# Altium schematic sheet MCU.SchDoc
size Letter
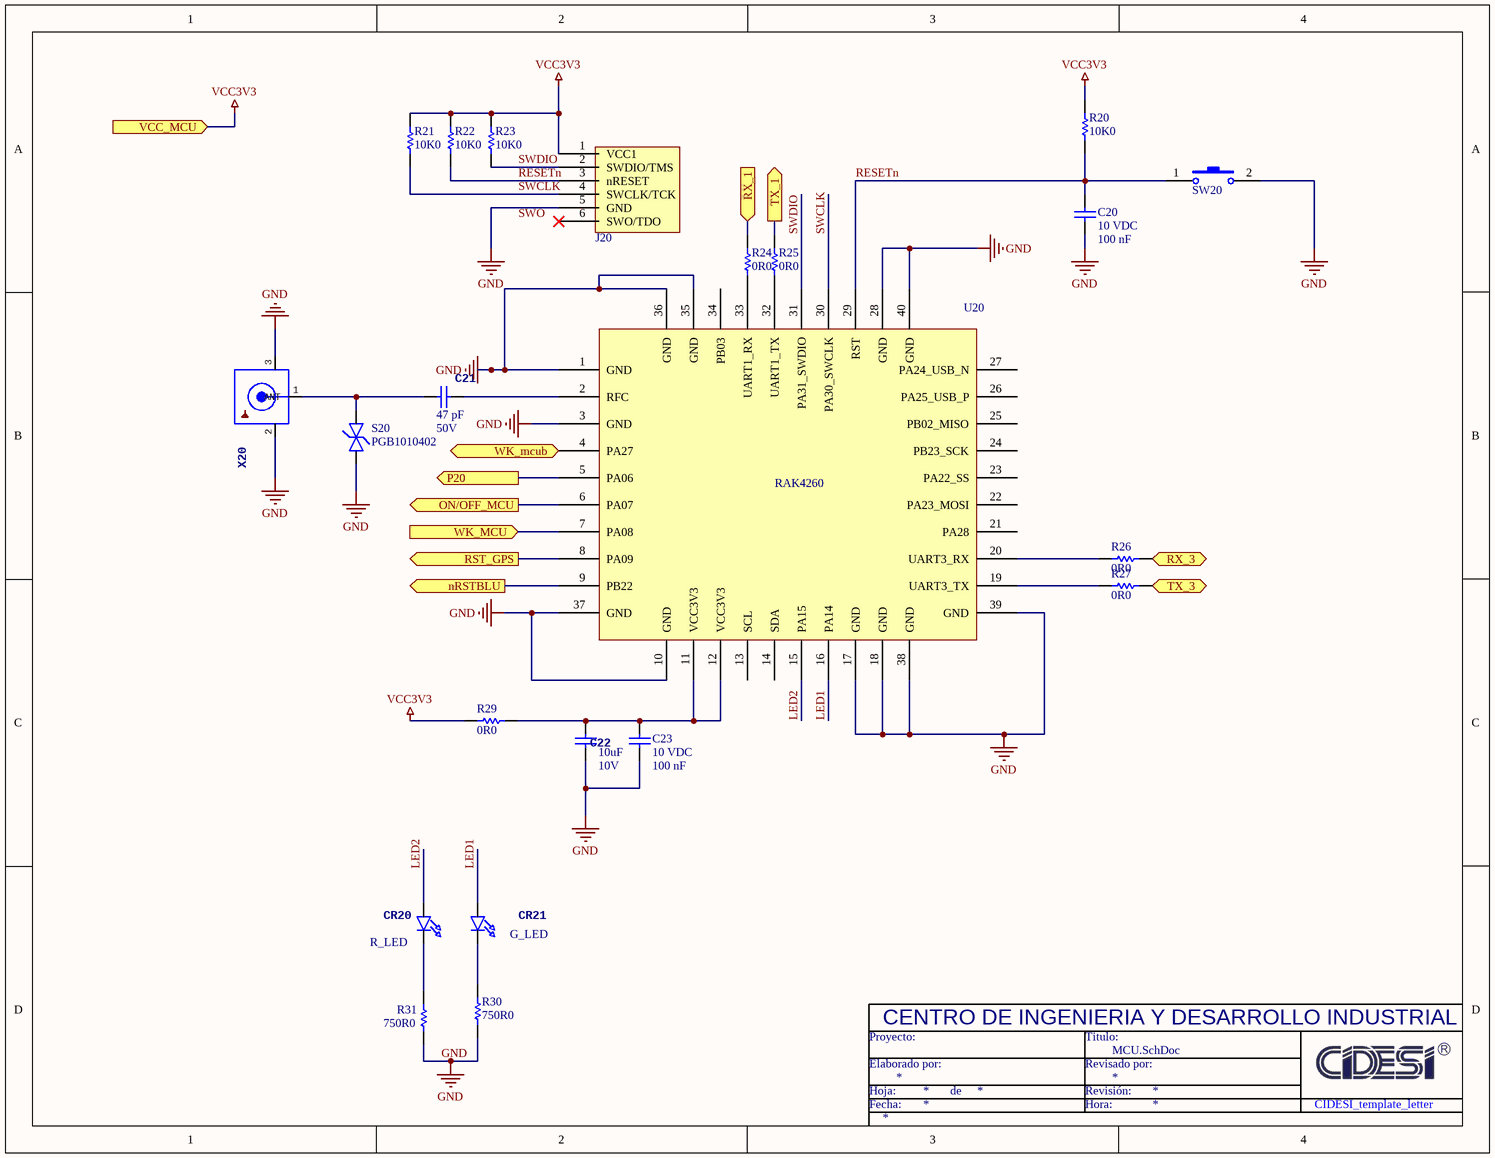
[diagram p0: MCU.SchDoc]

## Parts
C20  Voltage Rating DC: 10 VDC  Capacitance - nF: 100 nF  [C0402]  (hidden comment: 100 nF, 10 V)
C21  Capacitance: 47 pF  Voltage Rating DC: 50V  [C0402]  (hidden comment: GCQ1555C1H470JB01D)
C22  Capacitance: 10uF  Voltage Rating DC: 10V  [C0402]  (hidden comment: ZRB15XR61A106ME01D)
C23  Voltage Rating DC: 10 VDC  Capacitance - nF: 100 nF  [C0402]  (hidden comment: 100 nF, 10 V)
CR20  Product: R_LED  [0603_LED]  (hidden comment: KO DELLS1.22-KHLI-24)
CR21  Product: G_LED  [0603_LED]  (hidden comment: KG DELMS1.22-PHQI-24-E6L6)
J20  ICSP  [TC2030-MCP-NL]  (value not drawn)
R20  value 10K0  [0402_RES]  (hidden comment: CRCW040210K0FKTD)
R21  value 10K0  [0402_RES]  (hidden comment: CRCW040210K0FKTD)
R22  value 10K0  [0402_RES]  (hidden comment: CRCW040210K0FKTD)
R23  value 10K0  [0402_RES]  (hidden comment: CRCW040210K0FKTD)
R24  PANASONIC ELECTRONIC COMPONENTS  [0402_RES]  (value not drawn)
R25  PANASONIC ELECTRONIC COMPONENTS  [0402_RES]  (value not drawn)
R26  PANASONIC ELECTRONIC COMPONENTS  [0402_RES]  (value not drawn)
R27  PANASONIC ELECTRONIC COMPONENTS  [0402_RES]  (value not drawn)
R29  PANASONIC ELECTRONIC COMPONENTS  [0402_RES]  (value not drawn)
R30  Resistance: 750R0  [0402_RES]  (hidden comment: ERJ-2GEJ751X)
R31  Resistance: 750R0  [0402_RES]  (hidden comment: ERJ-2GEJ751X)
S20  PGB1010402  [Supresor_0402]
SW20  95C04A3GWRT  [Push Button SMDsin]  (value not drawn)
U20  RAK4260  [RAK4260]
X20  RECE.20279.001E.01  [U.FL]  (value not drawn)

## Ports
nRSTBLU (out), ON/OFF_MCU (out), P20 (out), RST_GPS (out), RX_1 (in), RX_3 (in), TX_1 (out), TX_3 (out), VCC_MCU (in), WK_MCU (in), WK_mcub (in)

## Nets
GND: C20.2 C22.2 C23.2 J20.5(GND) R30.1 R31.2 S20.2 SW20.2 U20.1(GND) U20.3(GND) U20.10(GND) U20.17(GND) U20.18(GND) U20.28(GND) U20.35(GND) U20.36(GND) U20.37(GND) U20.38(GND) U20.39(GND) U20.40(GND) X20.2(GND) X20.3(GND)
VCC3V3: J20.1(VCC1) R20.2 R21.2 R22.2 R23.2 R29.1 ; port VCC_MCU
LED1: CR21.A U20.16(PA14)
LED2: CR20.A U20.15(PA15)
nRSTBLU: U20.9(PB22) ; port nRSTBLU
ON/OFF_MCU: U20.6(PA07) ; port ON/OFF_MCU
P20: U20.5(PA06) ; port P20
RESETn: C20.1 J20.3(nRESET) R20.1 R22.1 SW20.1 U20.29(RST)
RST_GPS: U20.8(PA09) ; port RST_GPS
RX_1: R24.2 ; port RX_1
RX_3: R26.2 ; port RX_3
SWCLK: J20.4(SWCLK/TCK) R21.1 U20.30(PA30_SWCLK)
SWDIO: J20.2(SWDIO/TMS) R23.1 U20.31(PA31_SWDIO)
TX_1: R25.2 ; port TX_1
TX_3: R27.2 ; port TX_3
WK_MCU: U20.7(PA08) ; port WK_MCU
WK_mcub: U20.4(PA27) ; port WK_mcub
NetC21_1: C21.1 S20.1 X20.1(ANT)
NetC21_2: C21.2 U20.2(RFC)
NetC22_1: C22.1 C23.1 R29.2 U20.11(VCC3V3) U20.12(VCC3V3)
NetCR20_K: CR20.K R31.1
NetCR21_K: CR21.K R30.2
NetR24_1: R24.1 U20.33(UART1_RX)
NetR25_1: R25.1 U20.32(UART1_TX)
NetR26_1: R26.1 U20.20(UART3_RX)
NetR27_1: R27.1 U20.19(UART3_TX)

Not connected (* = marked no-connect by the designer): J20 6(SWO/TDO)*; U20 13(SCL) 14(SDA) 21(PA28) 22(PA23_MOSI) 23(PA22_SS) 24(PB23_SCK) 25(PB02_MISO) 26(PA25_USB_P) 27(PA24_USB_N) 34(PB03)

## Notes on the sheet
- Labels drawn without touching a wire or pin: SWO
- Proyecto:
- CENTRO DE INGENIERIA Y DESARROLLO INDUSTRIAL
- Titulo:
- Fecha:
- Hoja:
- Elaborado por:
- de
- Hora:
- Revisión:
- Revisado por:
- CIDESI_template_letter

## Library data of the parts
C20 C23 = 100 nF, 10 V: Multilayer Ceramic Capacitors MLCC - SMD/SMT 0402 0.1uF 10volts X7R 10%; Manufacturer: Murata Electronics; Manufacturer Part Number: GRM155R71A104KA01D; Type: General Purpose MLCC; Capacitance - pF: 100000 pF; Qualification: Commercial; Supplier 1: Mouser; RoHS: RoHS Compliant; Category: Multilayer Ceramic Capacitors MLCC - SMD/SMT; Stock 1: 259611; Pricing 1: 1=0.100, 10=0.006, 100=0.004, 500=0.003, 10000=0.003 (USD); Capacitance: 0.1 uF; Height: 0.5 mm; Length: 1 mm; Package / Case: 0402 (1005 metric); Packaging: Reel; Product: General Type MLCCs; Series: GRM; Termination Style: SMD/SMT; Tolerance: 10 %; Width: 0.5 mm; Brand: Murata Electronics; Case Code - in: 0402; Case Code - mm: 1005; Dielectric: X7R; Maximum Operating Temperature: + 125 C; Minimum Operating Temperature: - 55 C; Standard Pack Qty: 10000; RoHS - Mouser: Y; Minimum Order Quantity: 1; Reeling: True; ComponentLink1URL: http://www.mouser.com/ds/2/281/c02e-2905.pdf; ComponentLink1Description: http://www.mouser.com/ds/2/281/c02e-2905.pdf; Supplier Part Number 1: 81-GRM155R71A104KA1D
C21 = 47pF, 50V: Cap_Cer; Manufacturer: Murata Electronics; Tolerance: 5 %; Type: High Q Chip Multilayer Ceramic Capacitors for Automotive; Dielectric: C0G (NP0); Qualification: AEC-Q200; Supplier 1: Mouser; Manufacturer Part Number: GCQ1555C1H470JB01D; RoHS: RoHS Compliant; Category: Multilayer Ceramic Capacitors MLCC - SMD/SMT; Stock 1: 18694; Pricing 1: 1=0.455, 10=0.319, 100=0.191, 500=0.143, 1000=0.121, 2500=0.100, 5000=0.095, 10000=0.086, 20000=0.083 (MXN); Height: 0.5 mm; Length: 1 mm; Package / Case: 0402 (1005 metric); Packaging: Cut Tape; Product: Automotive MLCCs; Series: GCQ; Termination Style: SMD/SMT; Width: 0.5 mm; Brand: Murata Electronics; Case Code - in: 0402; Case Code - mm: 1005; Maximum Operating Temperature: + 125 C; Minimum Operating Temperature: - 55 C; Product Type: Ceramic Capacitors; Standard Pack Qty: 10000; Subcategory: Capacitors; Termination: Standard; RoHS - Mouser: Y; Minimum Order Quantity: 1; Reeling: True; ComponentLink1URL: https://www.mouser.com/datasheet/2/281/GCQ1555C1HR51WB01-01-1154307.pdf; ComponentLink1Description: https://www.mouser.com/datasheet/2/281/GCQ1555C1HR51WB01-01-1154307.pdf; Supplier Part Number 1: 81-GCQ1555C1H470JB1D
C22 = 10uF, 10V: Cap_Cer; Manufacturer: Murata Electronics; Tolerance: 20 %; Type: General Purpose Multilayer Ceramic Chip Capacitor; Class: Class 2; Dielectric: X5R; Supplier 1: Mouser; Manufacturer Part Number: ZRB15XR61A106ME01D; RoHS: RoHS Compliant; Category: Multilayer Ceramic Capacitors MLCC - SMD/SMT; Stock 1: 361820; Pricing 1: 1=0.624, 10=0.436, 100=0.261, 500=0.196, 1000=0.165, 2500=0.137, 5000=0.129, 8000=0.117, 24000=0.113 (MXN); Height: 0.65 mm; Length: 1 mm; Package / Case: 0402 (1005 metric); Packaging: Cut Tape; Product: General Type MLCCs; Series: ZRB; Termination Style: SMD/SMT; Width: 0.5 mm; Brand: Murata Electronics; Case Code - in: 0402; Case Code - mm: 1005; Maximum Operating Temperature: + 85 C; Minimum Operating Temperature: - 55 C; Product Type: Ceramic Capacitors; Standard Pack Qty: 8000; Subcategory: Capacitors; Termination: Interposer Substrate; RoHS - Mouser: Y; Minimum Order Quantity: 1; Reeling: True; ComponentLink1URL: https://www.mouser.com/datasheet/2/281/ZRB15XR61A106ME01-01-1771691.pdf; ComponentLink1Description: https://www.mouser.com/datasheet/2/281/ZRB15XR61A106ME01-01-1771691.pdf; Supplier Part Number 1: 81-ZRB15XR61A106ME1D
CR20 = Led_Red_0603: Led_Red; Manufacturer: OSRAM Opto Semiconductors; Manufacturer Part Number: KR DELPS1.22-UHVI-26-H3Q4; Illumination Color: Red; Lens Color: Colorless; Luminous Intensity: 520 mcd; Viewing Angle: 120 deg; If - Forward Current: 20 mA; Lens Transparency: Clear; Vf - Forward Voltage: 2.2 V; Wavelength/Color Temperature: 617 nm; Product Status: New Product; Supplier 1: Mouser; RoHS: RoHS Compliant; Category: Standard LEDs - SMD; Stock 1: 22857; Pricing 1: 1=0.572, 10=0.346, 100=0.160, 1000=0.133, 5000=0.103, 10000=0.094, 25000=0.087, 50000=0.079, 100000=0.077 (MXN); Height: 0.6 mm; Length: 1.6 mm; Orientation: Top View; Package / Case: 0603 (1608 metric); Packaging: Cut Tape; Series: TOPLED E 1608; Width: 0.8 mm; Brand: OSRAM Opto Semiconductors; Mounting Style: SMD/SMT; Maximum Operating Temperature: + 110 C; Minimum Operating Temperature: - 40 C; Moisture Sensitive: Yes; Product Type: LED - Standard; Standard Pack Qty: 5000; Subcategory: LEDs; RoHS - Mouser: Y; Minimum Order Quantity: 1; Reeling: True; Supplier Part Number 1: 720-KRDELPS122A5163
CR21 = Led_Green_0603: Led_Green; Manufacturer: OSRAM Opto Semiconductors; Illumination Color: Green; Lens Color: Colorless; Luminous Intensity: 52 mcd; Viewing Angle: 120 deg; If - Forward Current: 20 mA; Lens Transparency: Clear; Vf - Forward Voltage: 2 V; Wavelength/Color Temperature: 570 nm; Product Status: New Product; Supplier Part Number 1: 32M3102; Supplier 2: Mouser; Manufacturer Part Number: KG DELMS1.22-PHQI-24-E6L6; RoHS: RoHS Compliant; Category: Standard LEDs - SMD; Stock 2: 7946; Pricing 2: 1=0.546, 10=0.317, 100=0.182, 1000=0.142, 5000=0.122, 10000=0.112, 25000=0.104, 50000=0.095, 100000=0.091 (MXN); Height: 0.6 mm; Length: 1.6 mm; Orientation: Top View; Package / Case: 0603 (1608 metric); Packaging: Cut Tape; Series: TOPLED E 1608; Width: 0.8 mm; Brand: OSRAM Opto Semiconductors; Mounting Style: SMD/SMT; Maximum Operating Temperature: + 110 C; Minimum Operating Temperature: - 40 C; Moisture Sensitive: Yes; Product Type: LED - Standard; Standard Pack Qty: 5000; Subcategory: LEDs; RoHS - Mouser: Y; Minimum Order Quantity: 1; Reeling: True; Supplier Part Number 2: 720-KGDELMS122A4854
J20 = ICSP: Footprint Programador; Manufacturer Part Number: No aplica
R20-R23 = 10 KOHM, 63 mW: Resistor; Manufacturer 1: VISHAY DALE; Supplier 1: Newark; Manufacturer Part Number: CRCW040210K0FKTD; RoHS: NO; Stock 1: 12163; Pricing 1: 1=0.073, 10=0.039, 100=0.023, 1000=0.019 (USD); ComponentLink1URL: http://www.farnell.com/datasheets/1914725.pdf; ComponentLink1Description: http://www.farnell.com/datasheets/1914725.pdf; Supplier Part Number 1: 96C9543
R24-R27 R29 = 0R0: Resistor; Manufacturer Part Number: ERJ-2GE0R00X; Product Range: ERJ2; Voltage Rating: 50; Resistor Case Style: 0402 [1005 Metric]; Power Rating: 100; Resistor Element Type: Thick Film; Supplier 1: Newark; Manufacturer: PANASONIC ELECTRONIC COMPONENTS; RoHS: YES; Stock 1: 130000; Pricing 1: 1=0.006, 10000=0.006 (USD); Resistance Tolerance: -; ComponentLink1URL: http://www.farnell.com/datasheets/2059623.pdf; ComponentLink1Description: http://www.farnell.com/datasheets/2059623.pdf; Supplier Part Number 1: 97W7189; Resistance: 0R0
R30 R31 = 750R0, 63mW: Resistor; Manufacturer: PANASONIC; Resistor Case Style: 0402 [1005 Metric]; Product Range: ERJ2; Voltage Rating: 50; Resistor Element Type: Thick Film; Power Rating: 100; Resistance Tolerance: ± 5%; Supplier 1: Newark; Manufacturer Part Number: ERJ-2GEJ751X; Stock 1: 36376; Pricing 1: 1=0.002, 25=0.002, 100=0.002, 250=0.002, 500=0.002, 1000=0.002 (USD); ComponentLink1URL: http://www.farnell.com/cad/1697902.zip; ComponentLink1Description: http://www.farnell.com/cad/1697902.zip; ComponentLink2URL: http://industrial.panasonic.com/cdbs/www-data/pdf/RDA0000/AOA0000C301.pdf; ComponentLink2Description: http://industrial.panasonic.com/cdbs/www-data/pdf/RDA0000/AOA0000C301.pdf; Supplier Part Number 1: 53W4178
S20 = PGB1010402: ESD Suppressor; Manufacturer: Littelfuse; Manufacturer Part Number: PGB1010402KR; Clamping Voltage: 250 V; Number of Channels: 1 Channel; Cd - Diode Capacitance: 0.04 pF; Operating Supply Voltage: 12 VDC; Polarity: Bidirectional; Vesd - Voltage ESD Air Gap: 15 kV; Vesd - Voltage ESD Contact: 8 kV; Working Voltage: 12 V; Supplier 1: Mouser; RoHS: RoHS Compliant; Category: ESD Suppressors / TVS Diodes; Stock 1: 46461; Pricing 1: 1=0.754, 10=0.614, 100=0.386, 1000=0.298, 2500=0.254, 10000=0.237, 20000=0.224, 50000=0.218 (MXN); Package / Case: 0402 (1005 metric); Packaging: Cut Tape; Series: PGB10402; Termination Style: SMD/SMT; Brand: Littelfuse; Maximum Operating Temperature: + 125 C; Minimum Operating Temperature: - 65 C; Product Type: ESD Suppressors; Standard Pack Qty: 10000; Subcategory: TVS Diodes / ESD Suppression Diodes; RoHS - Mouser: Y; Minimum Order Quantity: 1; Reeling: True; ComponentLink1URL: https://www.mouser.com/datasheet/2/240/Littelfuse_PulseGuard_PGB1_Datasheet.pdf-461684.pdf; ComponentLink1Description: https://www.mouser.com/datasheet/2/240/Littelfuse_PulseGuard_PGB1_Datasheet.pdf-461684.pdf; Supplier Part Number 1: 576-PGB1010402KR
SW20 = Push Buttom-SMD_large: Push Button SMD large; Manufacturer: Grayhill; Actuator: Rectangular; Contact Form: SPST; Current Rating: 50 mA; Operating Force: 160 g; Stem Height: 4.3 mm; Switch Function: OFF - (ON); Voltage Rating DC: 12 VDC; Ground Terminal: No; Illuminated: Non-Illuminated; Mounting Direction: Straight; Travel: 0.01 in; Supplier 1: Mouser; Manufacturer Part Number: 95C04A3GWRT; RoHS: RoHS Compliant; Category: Tactile Switches; Stock 1: 1446; Pricing 1: 1=0.650, 10=0.594, 100=0.450, 1000=0.332, 1800=0.315, 9000=0.298, 23400=0.291, 48600=0.281 (MXN); Color: Brown; Contact Plating: Silver; Height: 4.3 mm; Illumination Color: -; Length: 6 mm; Mounting Type: Snap-In; Packaging: Cut Tape; Power Rating: -; Product: Tactile Switches; Termination Style: Gull Wing Lead; Type: Momentary Pushbutton; Voltage Rating AC: -; Width: 3.5 mm; Brand: Grayhill; Lamp Type: -; Mounting Style: SMD/SMT; Maximum Operating Temperature: + 70 C; Minimum Operating Temperature: - 25 C; Product Type: Tactile Switches; Standard Pack Qty: 1800; Subcategory: Switches; RoHS - Mouser: Y; Minimum Order Quantity: 1; Reeling: True; ComponentLink1URL: https://www.mouser.com/datasheet/2/626/Tact_95C04-335311.pdf; ComponentLink1Description: https://www.mouser.com/datasheet/2/626/Tact_95C04-335311.pdf; Supplier Part Number 1: 706-95C04A3GWRT
U20 = RAK4260: MODULO LORA; Manufacturer 1: RAK; Manufacturer Part Number: RAK4260 LoRa® Module - US915; ComponentLink1URL: https://store.rakwireless.com/collections/lora-modules/products/rak4260-lora-module?variant=31767043735597
X20 = SMACONNECTOR_UFL: Connector UFL; Manufacturer: Taoglas; Supplier 1: Mouser; Manufacturer Part Number: RECE.20279.001E.01; RoHS: RoHS Compliant; Category: RF Connectors / Coaxial Connectors; Stock 1: 0; Brand: Taoglas; Product Type: RF Connectors / Coaxial Connectors; Subcategory: RF Interconnects; Minimum Order Quantity: 1; Reeling: False; Supplier Part Number 1: N/A